# EAGLE design 114_uv_1_0_4 (EAGLE 9.6.0)
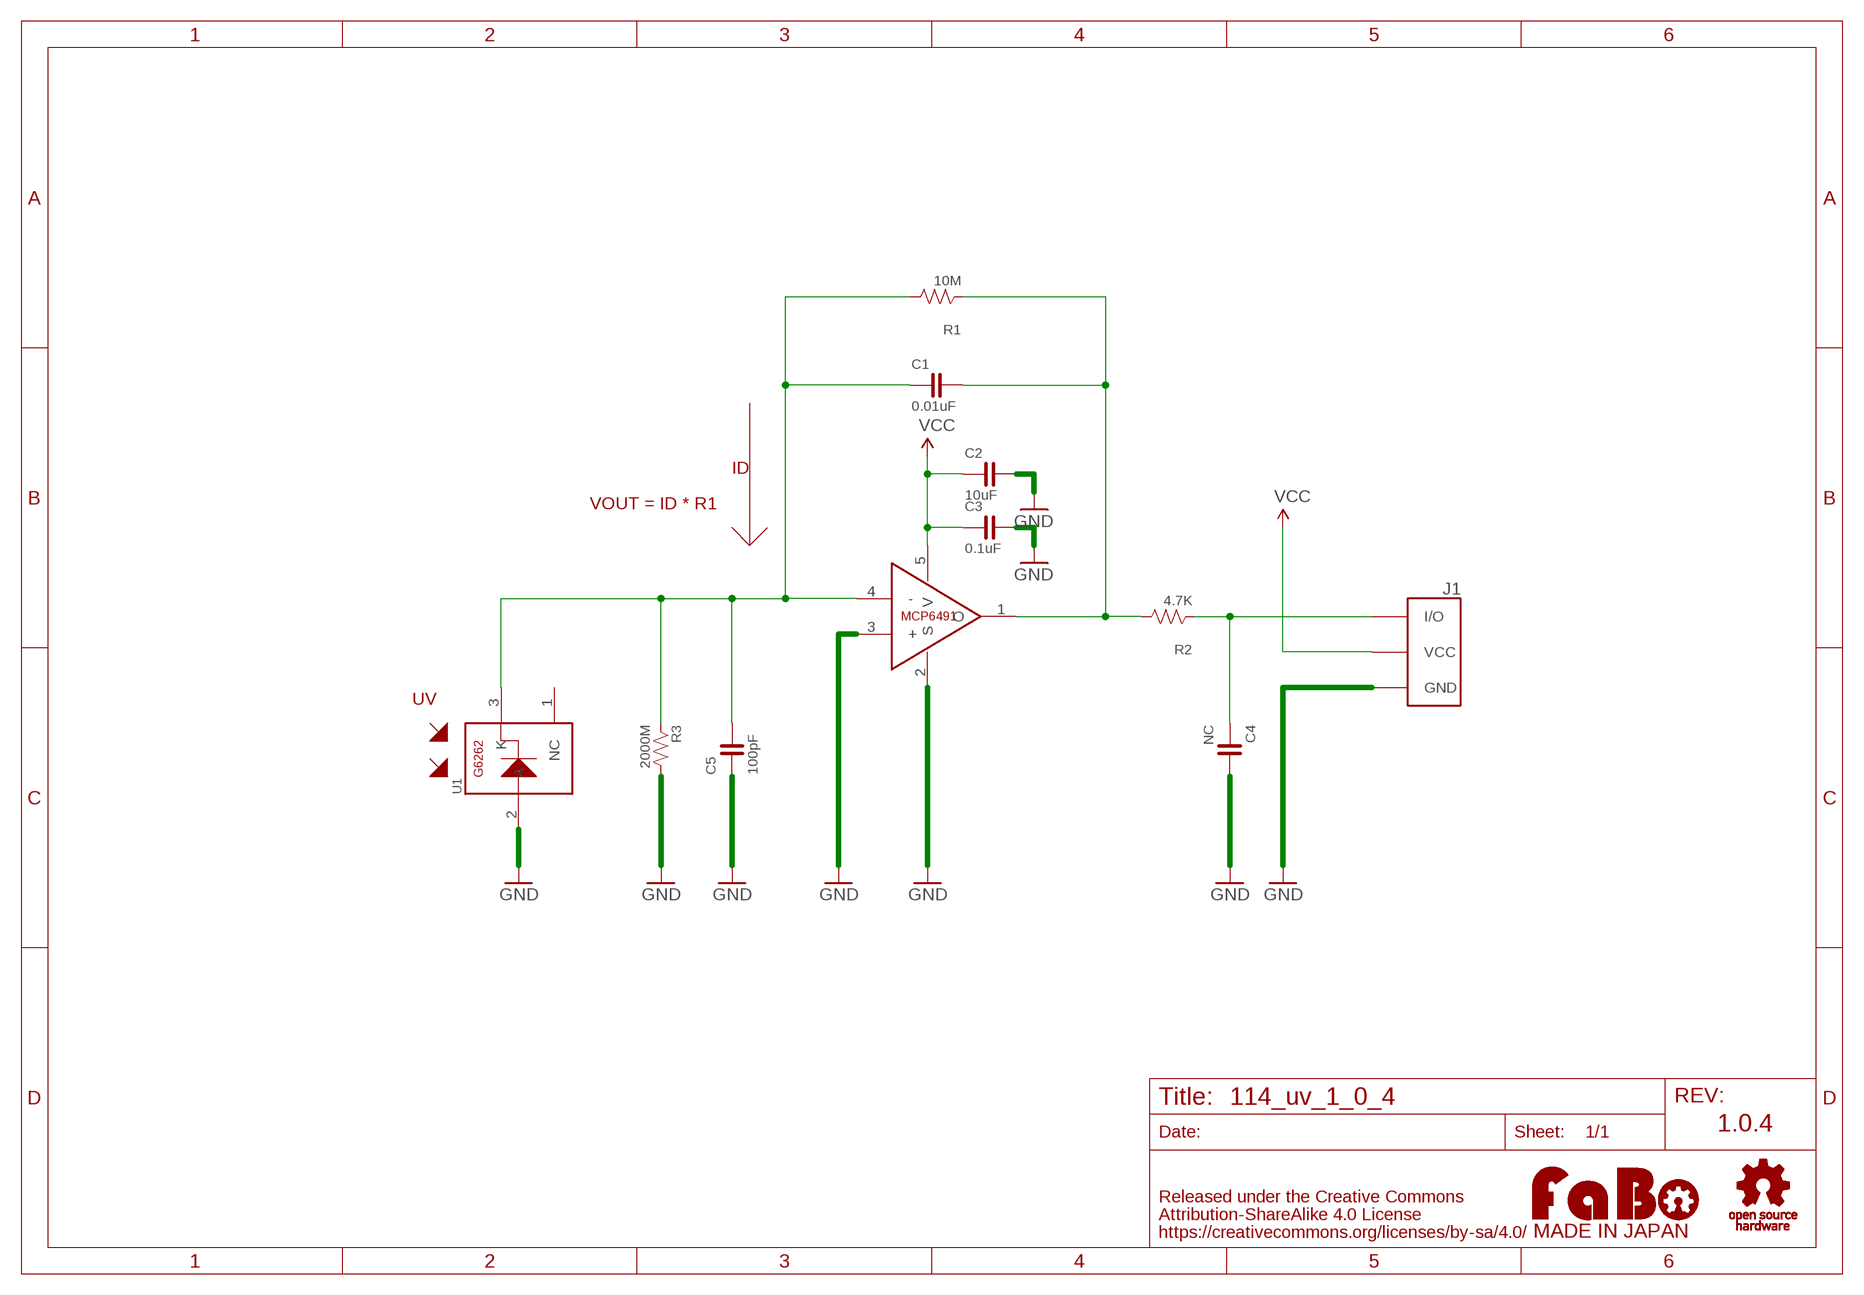
[diagram p0: schematic, sheet 1]

## Parts
C1  0.01uF  CAPACITOR-0603_NARROW  [0603-NARROW]
C2  10uF  CAPACITOR-0603_NARROW  [0603-NARROW]
C3  0.1uF  CAPACITOR-0603_NARROW  [0603-NARROW]
C4  NC  CAPACITOR-0603_NARROW  [0603-NARROW]
C5  100pF  CAPACITOR-0603_NARROW  [0603-NARROW]
J1  PA-3  FABO_BRICK_3PIN  [FABO_BRICK_3PIN]
R1  10M  RESISTOR-0603  [0603]
R2  4.7K  RESISTOR-0603  [0603]
R3  2000M  RESISTOR-0603  [0603]
U1  G6262  HAMAMATSU-GAASP-G6262  [GAASP-G6262]
U$2  OPENLOGO  LOGO_OSHW-M_BOTTOM  [LOGO_OSHW_M_BOTTOM]
U$3  FaBo Made in Japan  LOGO_FABO-M  [LOGO_FABO_MS]
U$4  MCP6491  [SOT-23]

## Nets
GND: C2.2 C3.2 C4.2 C5.1 J1.GND R3.2 U1.2(A) U$4.2(S) U$4.3(+)
N$1: C1.1 C5.2 R1.2 R3.1 U1.3(K) U$4.4(-)
N$2: C4.1 J1.I/O R2.1
N$4: C1.2 R1.1 R2.2 U$4.1(O)
VCC: C2.1 C3.1 J1.VCC U$4.5(V)
Unconnected: U1.1(NC)

## Notes on the sheet
- ID
- VOUT = ID * R1
- UV
- 1.0.4

## Library data of the parts
C1-C5 = FaBo-Capacitor:CAPACITOR: CAPACITOR
J1 = FaBo-Template:FABO_BRICK_3PIN: FaBo Brick 3pin
R1 = FaBo-Resistors:RESISTOR: RESISTOR; SPICEPREFIX: R
R2 R3 = FaBo-Resistors:RESISTOR: RESISTOR
U1 = FaBo-Sensor:HAMAMATSU-GAASP-G6262: GaAsP G6262
U$2 = FaBo-etc:LOGO_OSHW
U$3 = FaBo-etc:LOGO_FABO
U$4 = FaBo-Opamp:MCP6491

## Board
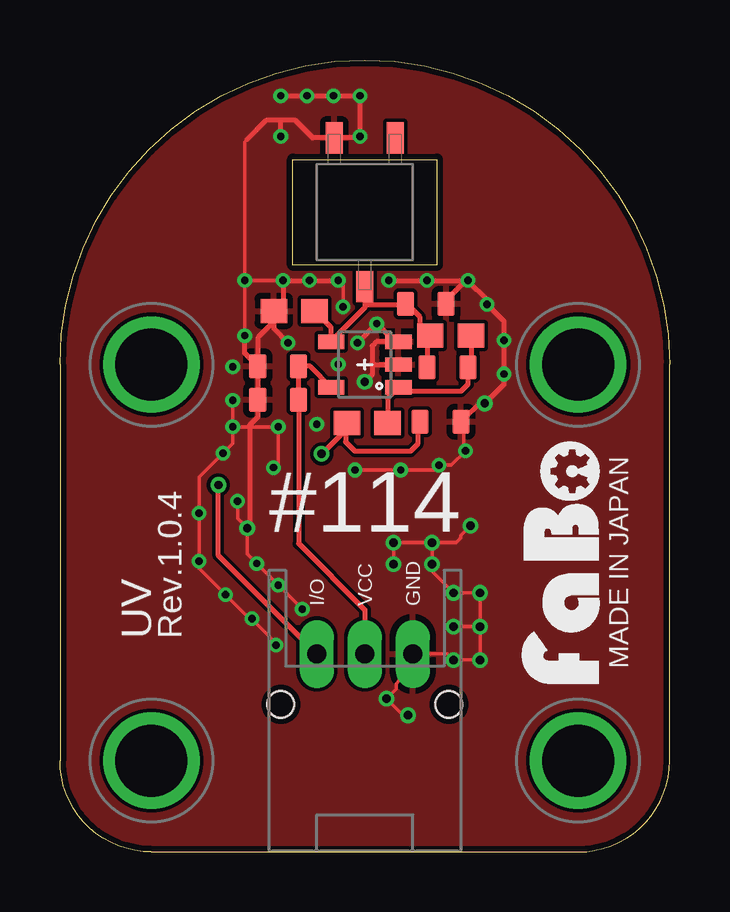
[diagram p1: board, top side]
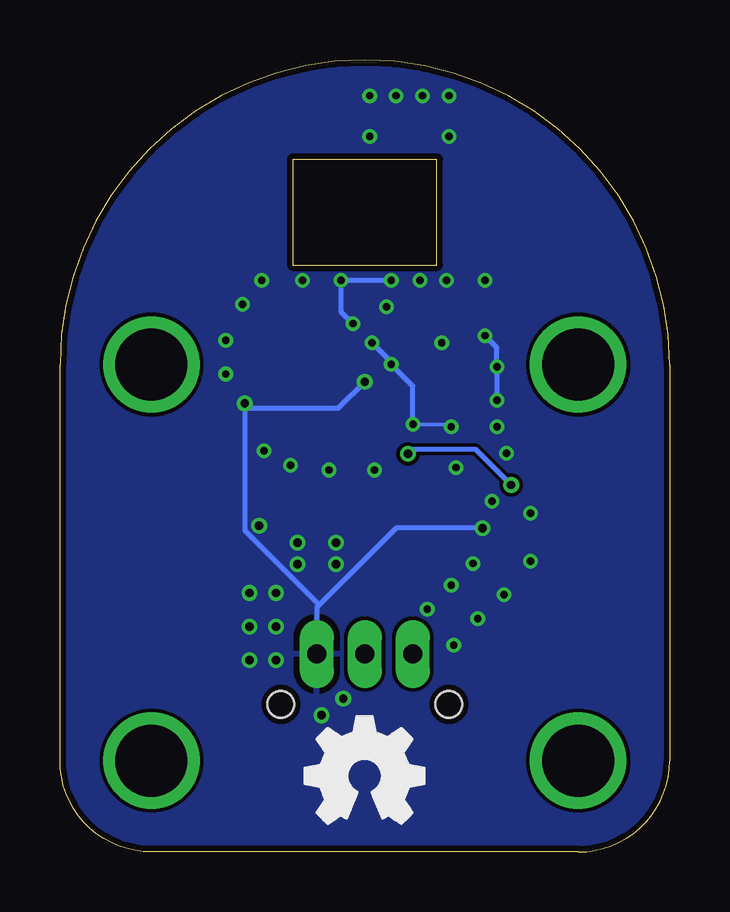
[diagram p2: board, bottom side, seen from below]

Size 25.4 x 33.02 mm. Coordinates in mm from the lower left corner, seen from the top.
Copper layers (1*16): Top 0.035mm / dielectric 1.5mm / Bottom 0.035mm
Design rules "SeeedStudio_2layer_DRU_no_angle_20140221": minimum track width 6mil, minimum drill 12mil, track to track 6mil, track to pad 6mil, pad to pad 6mil, via to via 6mil, smd to smd 0mil, copper to edge 10mil, drill to drill 10mil, minimum pad ring 10mil, minimum via ring 6mil, stop-mask expansion 2mil, vias tented up to drill 100mil, thermal gap 10mil

### Footprints (pad centres in the part's own frame; a part is rotated, then mirrored left to right if it is on the bottom)
0603-NARROW = smd 0.71 x 1: 1 -0.85,0; 2 0.85,0
FABO_BRICK_3PIN = drill 0.8 pad 1.422 long: GND 2,-8.255; I/O -2,-8.255; VCC 0,-8.255 | drill 3 pad 3.81: P$1 -8.89,3.81; P$2 8.89,3.81; P$3 -8.89,-12.7; P$4 8.89,-12.7 | hole 1.1: -3.5,-10.355; 3.5,-10.355
0603 = smd 1.1 x 1: 1 -0.85,0; 2 0.85,0
GAASP-G6262 = smd 0.7 x 1.3: 1 -1.27,-3.104; 2 1.27,-3.104; 3 0,3.104
SOT-23 = smd 0.6 x 1.1: 1 -0.95,-1.4; 2 0,-1.4; 3 0.95,-1.4; 4 0.95,1.4; 5 -0.95,1.4

### Placement (x,y rotation side)
C1  16.14,20.2 0 top
C2  9.09,18.86 180 top
C3  9.09,20.25 180 top
C4  15.86,17.95 0 top
C5  15.24,22.86 180 top
J1  12.7,16.51 0 top
R1  16.27,21.52 180 top
R2  12.8,17.88 0 top
R3  9.76,22.56 180 top
U1  12.7,26.67 180 top
U$2  12.7,3.17 0 top
U$3  22.86,12.06 90 top
U$4  12.7,20.32 90 top

### Tracks (layer width: path | path; a pad name or v marks a point on that pad's centre or on a via)
GND  (via drill 0.3, 0.35)
  Top 0.152: v14.5,5.7 14.3,5.7 v13.6,6.4 14,6.8 14,7.01 14.14,7.16 14.14,7.7 J1.GND 16.14,8.26 v16.4,8 v17.5,8 17.5,9.3 | 17.5,9.3 v17.5,9.4 v17.5,10.8 v16.4,10.8 15.5,11.7 v15.5,12 v15.5,12.9 | v16.4,9.4 17.4,9.4 17.5,9.3 | v15.5,12.9 v13.9,12.9 v13.9,12 | v15.5,12.9 16.5,12.9 16.7,13.1 16.7,13.2 v17.1,13.6 | v11.6,23.83 11.8,23.63 v11.8,22.73 | v12.3,15.93 v14.2,15.93 15.6,15.93 v15.8,16.13 16.3,16.13 v16.9,16.73 16.83,16.79 16.83,18.07 | v7.2,18.83 v7.2,17.73 | v7.2,17.73 v9.1,17.73 9.1,16.23 v8.9,16.03 | v7.2,17.73 7.2,17.03 v6.8,16.63 5.8,15.63 v5.8,14.13 v5.8,12.13 5.8,11.83 v6.9,10.73 7.9,9.73 v8,9.73 9,8.73 v9,8.63 | v10.1,10.13 v9.1,11.13 v8.2,12.03 7.8,12.42 v7.8,13.5 7.4,13.9 v7.4,14.63 | v7.7,23.83 v9.3,23.83 | v7.7,21.53 v7.7,23.83 | v7.7,23.83 7.7,29.6 7.8,29.7
  Top 0.203: U$4.3 13.95,21.27 | 13.95,21.27 13.17,21.27 13,21.1 13,20.4 | 13,20.4 13.08,20.32 U$4.2 | 13,20.4 13,19.9 v12.7,19.6 | C4.2 16.83,18.07 17.46,18.7 v17.7,18.7 18.5,19.5 v18.5,19.93 v18.5,21.33 18.5,22.13 v17.8,22.83 17.8,23.03 v17,23.83 16.9,23.83 | v7.8,13.5 7.9,13.6 7.9,17.8 8.24,18.14 C2.2 C3.2 | C3.2 8.24,21.44 8.91,22.11 R3.2 8.91,21.81 v9.5,21.23 | 9.2,30.5 9.8,30.5 10.53,29.77 U1.2 12.44,29.77 v12.5,29.83 v12.5,31.53 v11.4,31.53 v10.3,31.53 v9.2,31.53 | 9.2,30.5 8.6,30.5 7.8,29.7 | v9.2,29.83 9.2,30.5 | v11.6,23.83 v10.4,23.83 v9.3,23.83 9.3,22.88 9.21,22.79 | v13.7,23.83 v15.3,23.83 16.9,23.83 | C3.2 7.7,20.79 v7.7,21.53 | v12.4,21.23 v13.2,22.03 13.95,21.27 | C5.1 16.09,23.02 16.9,23.83
  Bottom 0.152: v7.2,18.83 7.3,18.72 | v9.1,17.73 9.2,17.83 v10.7,17.83
  Bottom 0.203: v12.7,19.6 13.8,18.5 17.5,18.5 v17.7,18.7 17.7,13.4 14.7,10.4 | v7.8,13.5 11.4,13.5 14.7,10.2 J1.GND | v13.2,22.03 13.7,22.53 v13.7,23.83 v11.6,23.83 | v10.7,17.83 10.7,19.43 v11.6,20.33 11.6,20.43 v12.4,21.23 | v7.2,18.83 v7.2,20.23 7.2,21.03 v7.7,21.53
  pour Bottom: 0,0 25.4,0 25.4,33.02 0,33.02
  pour Top: 0,0 25.4,0 25.4,33.02 0,33.02
N$1
  Top 0.203: C1.1 15.29,21.39 R1.2 15,21.95 15,22.3 14.44,22.86 C5.2 14.33,22.8 12.7,22.8 | U$4.4 11.3,21.3 | 11.3,21.3 11.3,21.87 R3.1 | U1.3 12.7,22.8 | 12.7,22.8 12.7,22.7 11.3,21.3
N$2  (via drill 0.35)
  Top 0.203: C4.1 14.9,17.84 14.9,17 14.6,16.7 12.3,16.7 11.9,17.1 11.9,17.6 | R2.1 11.9,17.83 11.9,17.6 | J1.I/O 6.6,12.36 v6.6,15.3 | v10.9,16.6 11.9,17.6
  Bottom 0.203: v6.6,15.3 8.1,16.8 10.7,16.8 v10.9,16.6
N$4
  Top 0.203: 14.2,19.47 U$4.1 | U$4.1 13.65,18.92 R2.2 | R1.1 17.12,20.33 C1.2 17,19.5 16.7,19.2 14.27,19.2 U$4.1
VCC
  Top 0.203: U$4.5 10.42,20.25 C3.1 C2.1 9.94,12.86 12.7,10.1 J1.VCC

### Text on the board
tPlace: #114 | MADE IN JAPAN | UV | Rev.1.0.4